# Altium schematic sheet AS5047P.SchDoc
size A
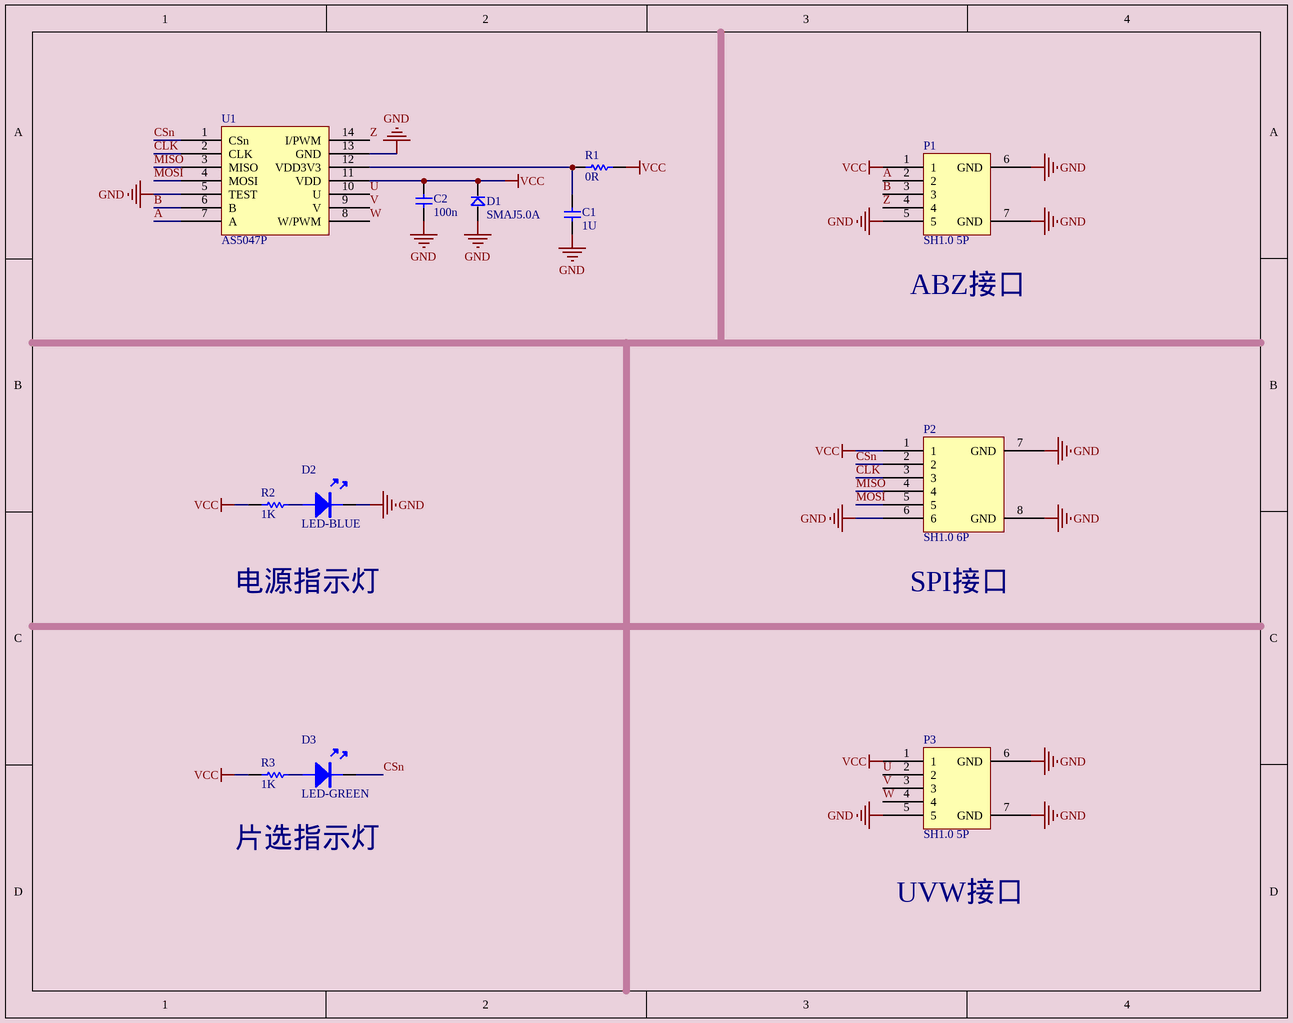
[diagram p0: AS5047P.SchDoc]

## Parts
C1  1U  [0603C]
C2  100n  [0603C]
D1  SMAJ5.0A  [SMA/DO-214AC]
D2  LED-BLUE  [LED-0603B]
D3  LED-GREEN  [LED-0603G]
P1  SH1.0 5P  [SH1.0 5P]
P2  SH1.0 6P  [SH1.0 6P]
P3  SH1.0 5P  [SH1.0 5P]
R1  0R  [0603RH]
R2  1K  [0603RH]
R3  1K  [0603RH]
U1  AS5047P  [AS5047P]

## Nets
GND: C1.1 C2.1 D1.A D2.K P1.5 P1.6(GND) P1.7(GND) P2.6 P2.7(GND) P2.8(GND) P3.5 P3.6(GND) P3.7(GND) U1.5(TEST) U1.13(GND)
VCC: C2.2 D1.K P1.1 P2.1 P3.1 R1.2 R2.1 R3.1 U1.11(VDD)
A: P1.2 U1.7(A)
B: P1.3 U1.6(B)
CLK: P2.3 U1.2(CLK)
CSn: D3.K P2.2 U1.1(CSn)
MISO: P2.4 U1.3(MISO)
MOSI: P2.5 U1.4(MOSI)
U: P3.2 U1.10(U)
V: P3.3 U1.9(V)
W: P3.4 U1.8(W/PWM)
Z: P1.4 U1.14(I/PWM)
NetC1_2: C1.2 R1.1 U1.12(VDD3V3)
NetD2_A: D2.A R2.2
NetD3_A: D3.A R3.2

## Notes on the sheet
- (near P1) ABZ接口
- 电源指示灯
- (near P2) SPI接口
- 片选指示灯
- UVW接口

## Library data of the parts
C1 C2 = CAP: 无极性电容
D1 = DIODE: 普通二极管
D2 D3 = LED
P1 P3 = SH1.0 5P: SH1.0 5P 卧贴
P2 = SH1.0 6P: SH1.0 6P 卧贴
R1-R3 = RES
U1 = AS5047P: AS5047P SSOP14